# EAGLE design mowgli_1 (EAGLE 7.6.0)
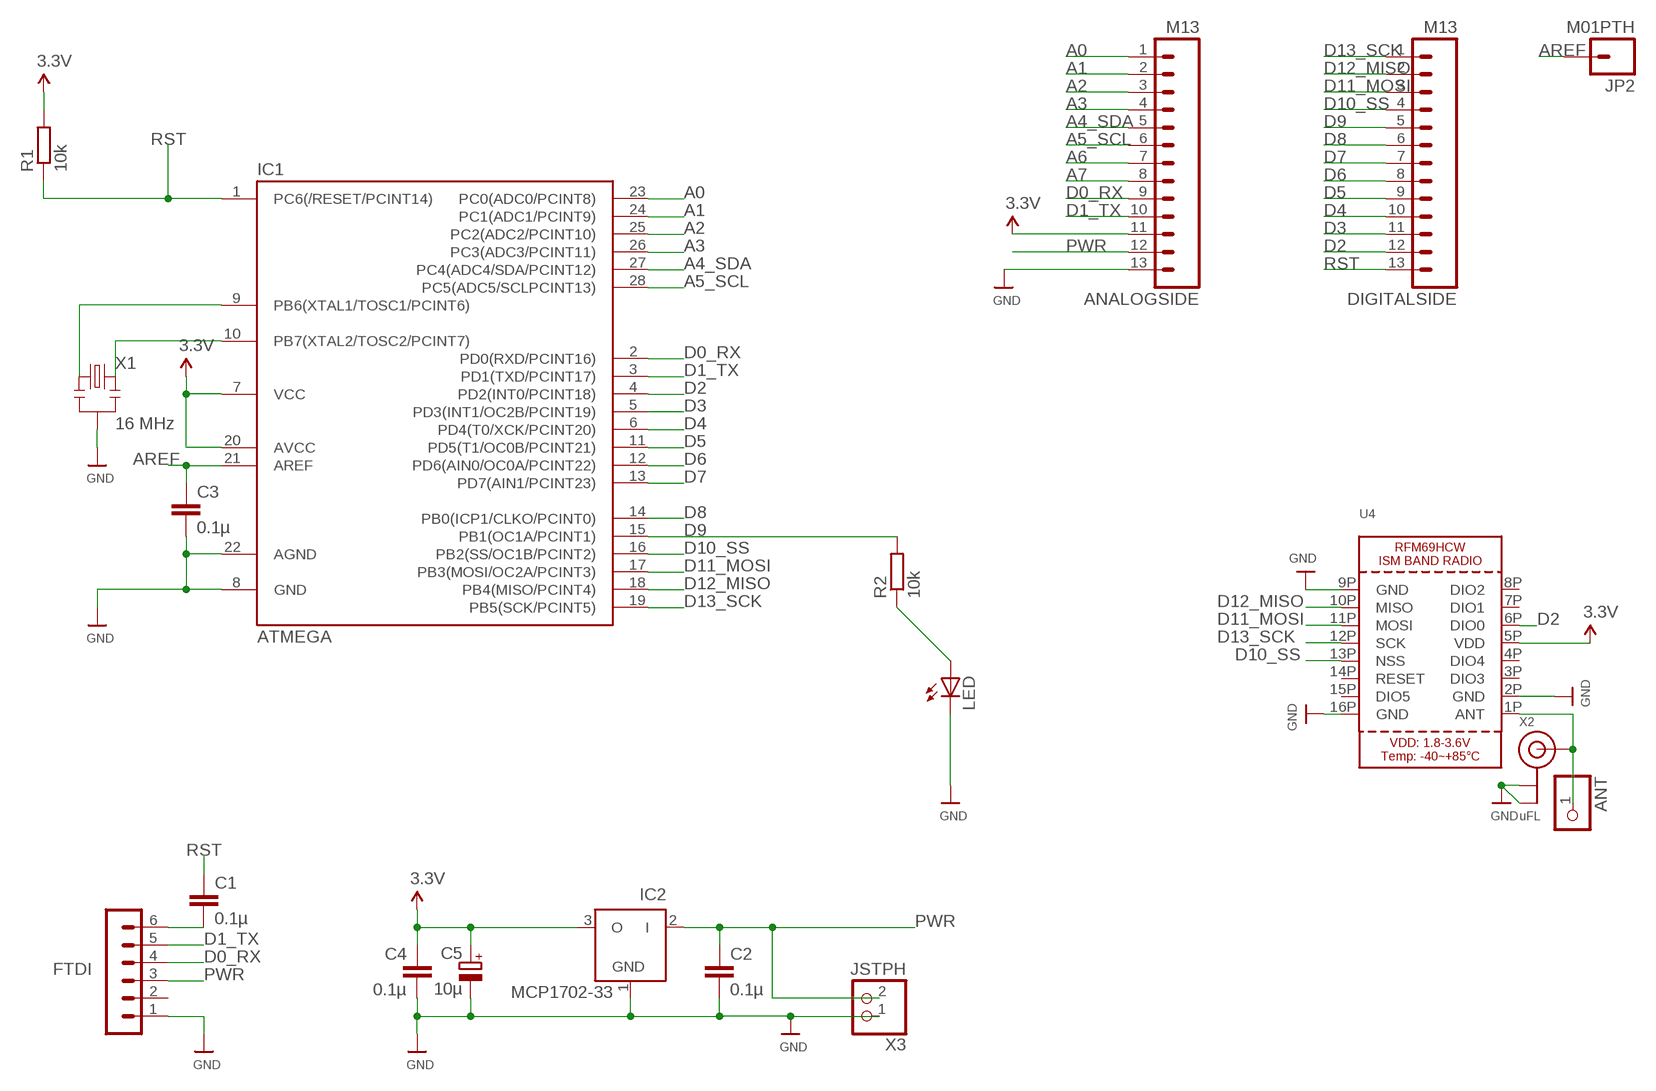
[diagram p0: schematic, sheet 1]

## Parts
ANALOGSIDE  M13  [1X13]
ANT  HEADER-1X1ROUND  [1X01_ROUND]
C1  0.1µ  C-EU025-024X044  [C025-024X044]
C2  0.1µ  C-EU025-024X044  [C025-024X044]
C3  0.1µ  C-EU025-024X044  [C025-024X044]
C4  0.1µ  C-EU025-024X044  [C025-024X044]
C5  10µ  CPOL-EUE1.8-4  [E1,8-4]
DIGITALSIDE  M13  [1X13]
FTDI  FTDI  MA06-1  [MA06-1]
IC1  ATMEGA  ATMEGA48/88/168-PU  [DIL28-3]
IC2  MCP1702-33  MCP1702Z  [TO92]
JP2  M01PTH  [1X01]
LED  LED3MM  [LED3MM]
R1  10k  R-EU_0204/7  [0204/7]
R2  10k  R-EU_0204/7  [0204/7]
U4  RFM69HCW_SMT  [RFMHCW_SMT]
X1  16 MHz  RESONATORPTH  [RESONATOR-PTH]
X2  uFL  ANTENNA_U.FL  [U.FL]
X3  JSTPH  CON_JST_PH_2PIN  [JSTPH2]

## Nets
A0: ANALOGSIDE.1 IC1.23(PC0(ADC0/PCINT8))
A1: ANALOGSIDE.2 IC1.24(PC1(ADC1/PCINT9))
A2: ANALOGSIDE.3 IC1.25(PC2(ADC2/PCINT10))
A3: ANALOGSIDE.4 IC1.26(PC3(ADC3/PCINT11))
A4_SDA: ANALOGSIDE.5 IC1.27(PC4(ADC4/SDA/PCINT12))
A5_SCL: ANALOGSIDE.6 IC1.28(PC5(ADC5/SCLPCINT13))
A6: ANALOGSIDE.7
A7: ANALOGSIDE.8
ANT: ANT.1 U4.1P(ANT) X2.3(SIGNAL)
AREF: C3.1 IC1.21(AREF) JP2.1
D0_RX: ANALOGSIDE.9 FTDI.4 IC1.2(PD0(RXD/PCINT16))
D1_TX: ANALOGSIDE.10 FTDI.5 IC1.3(PD1(TXD/PCINT17))
D2: DIGITALSIDE.12 IC1.4(PD2(INT0/PCINT18)) U4.6P(DIO0)
D3: DIGITALSIDE.11 IC1.5(PD3(INT1/OC2B/PCINT19))
D4: DIGITALSIDE.10 IC1.6(PD4(T0/XCK/PCINT20))
D5: DIGITALSIDE.9 IC1.11(PD5(T1/OC0B/PCINT21))
D6: DIGITALSIDE.8 IC1.12(PD6(AIN0/OC0A/PCINT22))
D7: DIGITALSIDE.7 IC1.13(PD7(AIN1/PCINT23))
D8: DIGITALSIDE.6 IC1.14(PB0(ICP1/CLKO/PCINT0))
D9: DIGITALSIDE.5 IC1.15(PB1(OC1A/PCINT1)) R2.2
D10_SS: DIGITALSIDE.4 IC1.16(PB2(SS/OC1B/PCINT2)) U4.13P(NSS)
D11_MOSI: DIGITALSIDE.3 IC1.17(PB3(MOSI/OC2A/PCINT3)) U4.11P(MOSI)
D12_MISO: DIGITALSIDE.2 IC1.18(PB4(MISO/PCINT4)) U4.10P(MISO)
D13_SCK: DIGITALSIDE.1 IC1.19(PB5(SCK/PCINT5)) U4.12P(SCK)
GND [power]: ANALOGSIDE.13 C2.2 C3.2 C4.2 C5.- FTDI.1 IC1.8(GND) IC1.22(AGND) IC2.1(GND) LED.K(C) U4.2P(GND) U4.9P(GND) U4.16P(GND) X1.2 X2.1(GND) X2.2(GND) X3.1
N$1: IC1.9(PB6(XTAL1/TOSC1/PCINT6)) X1.1
N$2: LED.A R2.1
N$20: C1.2 FTDI.6
N$21: IC1.10(PB7(XTAL2/TOSC2/PCINT7)) X1.3
PWR [power]: ANALOGSIDE.12 C2.1 FTDI.3 IC2.2(I) X3.2
RST: C1.1 DIGITALSIDE.13 IC1.1(PC6(/RESET/PCINT14)) R1.1
VCC [power]: ANALOGSIDE.11 C4.1 C5.+ IC1.7(VCC) IC1.20(AVCC) IC2.3(O) R1.2 U4.5P(VDD) ; supply symbol labelled 3.3V
Unconnected: FTDI.2 U4.3P(DIO3) U4.4P(DIO4) U4.7P(DIO1) U4.8P(DIO2) U4.14P(RESET) U4.15P(DIO5)

## Library data of the parts
ANALOGSIDE DIGITALSIDE = SparkFun-Connectors:M13: 13-pin single row .1" header
ANT = microbuilder:HEADER-1X1: PIN HEADER
C1-C4 = resistor:C-EU: CAPACITOR, European symbol
C5 = resistor:CPOL-EU: POLARIZED CAPACITOR, European symbol
FTDI = JeeLabs:MA06-1: PIN HEADER
IC1 = atmega8:ATMEGA48/88/168-PU
IC2 = JeeLabs:MCP1702: 200 mA, Low Power Low Dropout Voltage Regulator
JP2 = SparkFun-Connectors:M01: Header 1 Standard 1-pin 0.1" header. Use with straight break away headers (SKU : PRT-00116), right angle break away headers (PRT-00553), swiss pins (PRT-00743), machine pins (PRT-00117), and female headers (PRT-00115).
LED = led:LED: LED OSRAM: - CHIPLED LG R971, LG N971, LY N971, LG Q971, LY Q971, LO R971, LY R971 LH N974, LH R974 LS Q976, LO Q976, LY Q976 LO Q996 - Hyper CHIPLED LW Q18S LB Q993, LB Q99A, LB R99A - SideLED LS A670, LO A670, LY A670, LG A670, LP A670 LB A673, LV A673, LT A673, LW A673 LH A674 LY A675 LS A676, LA A676, LO A676, LY A676, LW A676 LS A679, LY A679, LG A679 - Hyper Micro SIDELED® LS Y876, LA Y876, LO Y876, LY Y876 LT Y87S - SmartLED LW L88C, LW L88S LB L89C, LB L89S, LG L890 LS L89K, LO L89K, LY L89K LS L896, LA L896, LO L896, LY L896 - TOPLED LS T670, LO T670, LY T670, LG T670, LP T670 LSG T670, LSP T670, LSY T670, LOP T670, LYG T670 LG T671, LOG T671, LSG T671 LB T673, LV T673, LT T673, LW T673 LH T674 LS T676, LA T676, LO T676, LY T676, LB T676, LH T676, LSB T676, LW T676 LB T67C, LV T67C, LT T67C, LS T67K, LO T67K, LY T67K, LW E67C LS E67B, LA E67B, LO E67B, LY E67B, LB E67C, LV E67C, LT E67C LW T67C LS T679, LY T679, LG T679 LS T770, LO T770, LY T770, LG T770, LP T770 LB T773, LV T773, LT T773, LW T773 LH T774 LS E675, LA E675, LY E675, LS T675 LS T776, LA T776, LO T776, LY T776, LB T776 LHGB T686 LT T68C, LB T68C - Hyper Mini TOPLED® LB M676 - Mini TOPLED Santana® LG M470 LS M47K, LO M47K, LY M47K Source: http://www.osram.convergy.de LUXEON: - LUMILED® LXK2-PW12-R00, LXK2-PW12-S00, LXK2-PW14-U00, LXK2-PW14-V00 LXK2-PM12-R00, LXK2-PM12-S00, LXK2-PM14-U00 LXK2-PE12-Q00, LXK2-PE12-R00, LXK2-PE12-S00, LXK2-PE14-T00, LXK2-PE14-U00 LXK2-PB12-K00, LXK2-PB12-L00, LXK2-PB12-M00, LXK2-PB14-N00, LXK2-PB14-P00, LXK2-PB14-Q00 LXK2-PR12-L00, LXK2-PR12-M00, LXK2-PR14-Q00, LXK2-PR14-R00 LXK2-PD12-Q00, LXK2-PD12-R00, LXK2-PD12-S00 LXK2-PH12-R00, LXK2-PH12-S00 LXK2-PL12-P00, LXK2-PL12-Q00, LXK2-PL12-R00 Source: www.luxeon.com KINGBRIGHT: KA-3528ASYC Source: www.kingbright.com
R1 R2 = resistor:R-EU_: RESISTOR, European symbol
U4 = microbuilder:RFM69HCW: RFM69HCW - ISM Band RF Transceiver
X1 = SparkFun:RESONATOR: Resonator Small SMD resonator. This is the itty bitty 10/20MHz resonators with built in caps. CSTCE10M0G55 and CSTCE20M0V53. Footprint has been reviewed closely but hasn't been tested yet.
X2 = microbuilder:ANTENNA_U.FL: U.FL Antenna Connector
X3 = microbuilder:CON_JST_PH_2PIN: JST 2-Pin Right-Angle Connector PH-Series - 4UConnector: 17311 SH-Series - 4UConnector: 07278

## Net classes
1 power: width 0.381 mm, clearance 0.254 mm

## Board
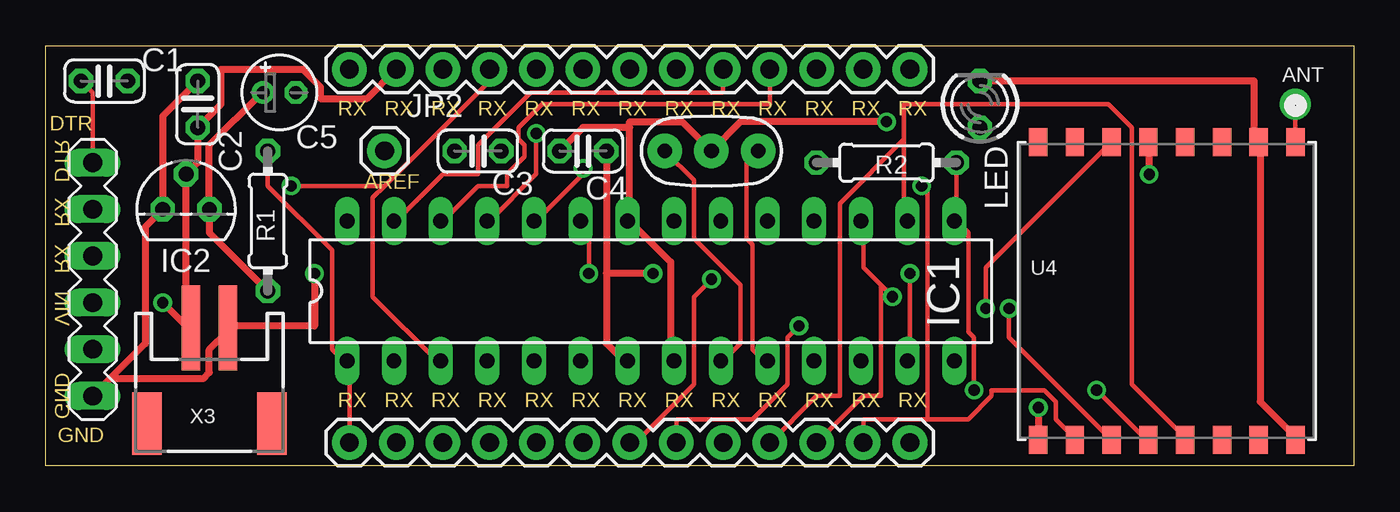
[diagram p1: board, top side]
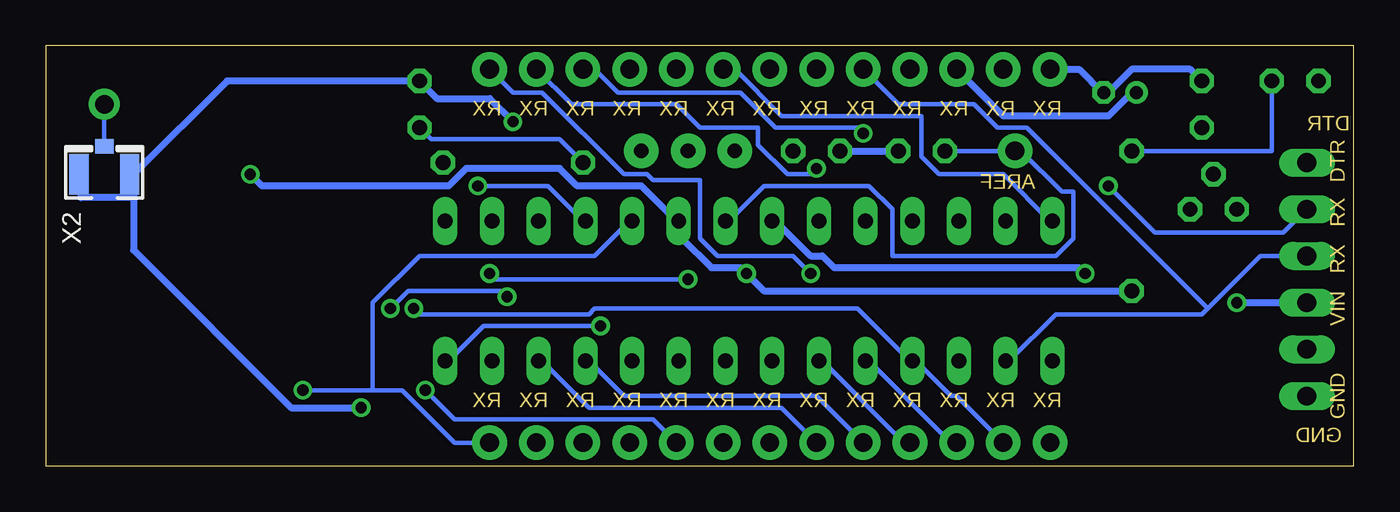
[diagram p2: board, bottom side, seen from below]

Size 71.12 x 22.86 mm. Coordinates in mm from the lower left corner, seen from the top.
Outline: 0,0 0,22.86 71.12,22.86 71.12,0 0,0
Copper layers (1*16): Top 0.035mm / dielectric 1.5mm / Bottom 0.035mm
Design rules "default": minimum track width 10mil, minimum drill 24mil, track to track 8mil, track to pad 8mil, pad to pad 8mil, via to via 8mil, smd to smd 8mil, copper to edge 40mil, drill to drill 8mil, minimum pad ring 10mil, minimum via ring 8mil, stop-mask expansion 4mil, vias tented up to drill 0mil, thermal gap 10mil

### Footprints (pad centres in the part's own frame; a part is rotated, then mirrored left to right if it is on the bottom)
1X13 = drill 1.016 pad 1.88: 1 0,0; 2 2.54,0; 3 5.08,0; 4 7.62,0; 5 10.16,0; 6 12.7,0; 7 15.24,0; 8 17.78,0; 9 20.32,0; 10 22.86,0; 11 25.4,0; 12 27.94,0; 13 30.48,0
1X01_ROUND = drill 1 pad 1.676: 1 0,0
C025-024X044 = drill 0.813 octagon: 1 -1.27,0; 2 1.27,0
E1,8-4 = drill 0.711 pad 1.168: + -0.889,0 | drill 0.711 pad 1.168 octagon: - 0.889,0
MA06-1 = drill 1.016 long: 1 0,0; 2 2.54,0; 3 5.08,0; 4 7.62,0; 5 10.16,0; 6 12.7,0
DIL28-3 = drill 0.813 long: 1 -16.51,-3.81; 2 -13.97,-3.81; 3 -11.43,-3.81; 4 -8.89,-3.81; 5 -6.35,-3.81; 6 -3.81,-3.81; 7 -1.27,-3.81; 8 1.27,-3.81; 9 3.81,-3.81; 10 6.35,-3.81; 11 8.89,-3.81; 12 11.43,-3.81; 13 13.97,-3.81; 14 16.51,-3.81; 15 16.51,3.81; 16 13.97,3.81; 17 11.43,3.81; 18 8.89,3.81; 19 6.35,3.81; 20 3.81,3.81; 21 1.27,3.81; 22 -1.27,3.81; 23 -3.81,3.81; 24 -6.35,3.81; 25 -8.89,3.81; 26 -11.43,3.81; 27 -13.97,3.81; 28 -16.51,3.81
TO92 = drill 0.813 octagon: 1 -1.27,0; 2 0,1.905; 3 1.27,0
1X01 = drill 1.016 pad 1.88: 1 0,0
LED3MM = drill 0.813 octagon: A -1.27,0; K 1.27,0
0204/7 = drill 0.813 octagon: 1 -3.81,0; 2 3.81,0
RFMHCW_SMT = smd 1.5 x 1: 1P 8.1,-7; 2P 8.1,-5; 3P 8.1,-3; 4P 8.1,-1; 5P 8.1,1; 6P 8.1,3; 7P 8.1,5; 8P 8.1,7; 9P -8.1,7; 10P -8.1,5; 11P -8.1,3; 12P -8.1,1; 13P -8.1,-1; 14P -8.1,-3; 15P -8.1,-5; 16P -8.1,-7
RESONATOR-PTH = drill 0.8 pad 1.88: 1 -2.54,0; 2 0,0; 3 2.54,0
U.FL = smd 2.2 x 1.05: 1 0,1.375; 2 0,-1.375 | smd 0.8 x 1: 3 1.525,0
JSTPH2 = smd 1 x 4.6: 1 -1,-3.7; 2 1,-3.7 | smd 1.6 x 3.4: NC1 -3.4,1.5; NC2 3.4,1.5

### Placement (x,y rotation side)
ANALOGSIDE  46.99,21.59 180 top
ANT  67.94,19.68 0 top
C1  3.17,20.95 180 top
C2  8.26,19.68 90 top
C3  23.5,17.14 0 top
C4  29.21,17.14 180 top
C5  12.7,20.32 0 top
DIGITALSIDE  46.99,1.27 180 top
FTDI  2.54,3.81 90 top
IC1  32.89,9.53 0 top
IC2  7.62,13.97 0 top
JP2  18.41,17.14 0 top
LED  50.8,19.68 90 top
R1  12.06,13.34 270 top
R2  45.72,16.51 0 top
U4  60.96,9.53 90 top
X1  36.2,17.14 0 top
X2  67.94,15.88 90 bottom
X3  8.89,3.81 180 top

### Tracks (layer width: path | path; a pad name or v marks a point on that pad's centre or on a via)
A0  (via drill 0.61)
  Top 0.254: v29.53,10.48 29.53,13.02 29.21,13.34 IC1.23
  Bottom 0.254: v29.53,10.48 30.48,11.43 34.61,11.43 35.56,12.38 35.56,15.56 38.1,15.56 38.42,15.88 39.69,15.88 44.13,20.32 45.72,20.32 ANALOGSIDE.1
A1  (via drill 0.61)
  Top 0.254: v29.21,16.19 29.21,15.88 26.67,13.34 IC1.24
  Bottom 0.254: v29.21,16.19 29.53,15.88 30.8,15.88 32.38,17.46 32.38,18.41 35.56,18.41 36.83,19.68 42.55,19.68 ANALOGSIDE.2
A2  (via drill 0.61)
  Top 0.254: v26.67,18.1 26.67,15.88 24.13,13.34 IC1.25
  Bottom 0.254: v26.67,18.1 26.99,18.41 31.43,18.41 33.34,20.32 40.01,20.32 41.27,21.59 ANALOGSIDE.3
A3
  Top 0.254: ANALOGSIDE.4 39.37,19.68 26.99,19.68 25.72,18.41 25.72,17.78 26.04,17.46 26.04,16.83 25.08,15.88 25.08,15.24 23.5,15.24 21.59,13.34 IC1.26
A4_SDA
  Top 0.254: ANALOGSIDE.5 36.83,20.32 26.35,20.32 23.5,17.46 23.5,15.88 21.59,15.88 19.05,13.34 IC1.27
A5_SCL
  Bottom 0.254: ANALOGSIDE.6 33.66,21.59 31.11,19.05 23.5,19.05 23.5,16.83 22.54,15.88 19.05,15.88 16.51,13.34 IC1.28
ANT
  Top 0.254: ANT.1 67.94,17.78 U4.1P
  Bottom 0.254: ANT.1 X2.3
AREF
  Bottom 0.254: IC1.21 33.97,13.34 32.07,15.24 26.35,15.24 25.08,13.97 25.08,11.43 16.19,11.43 15.24,12.38 15.24,14.92 15.88,14.92 18.1,17.14 JP2.1 C3.1
D0_RX
  Bottom 0.254: 7.94,8.57 5.08,11.43 FTDI.4 | 7.94,8.57 8.26,8.26 16.19,8.26 18.73,5.71 IC1.2 | ANALOGSIDE.9 24.77,19.68 20.64,19.68 19.37,18.41 17.78,18.41 7.94,8.57
D1_TX  (via drill 0.61)
  Top 0.254: 18.41,15.24 24.13,20.95 ANALOGSIDE.10 | 18.41,15.24 17.78,14.61 17.78,9.21 21.27,5.71 IC1.3 | 18.41,15.24 v13.34,15.24
  Bottom 0.254: FTDI.5 3.81,12.7 10.79,12.7 v13.34,15.24
D2  (via drill 0.61)
  Top 0.254: v51.12,8.57 51.12,10.79 57.78,17.46 U4.6P
  Bottom 0.254: v51.12,8.57 50.8,8.26 41.59,8.26 41.27,8.57 26.99,8.57 24.13,5.71 IC1.4 23.81,5.71 21.91,3.81 21.59,3.81 DIGITALSIDE.12
D3
  Bottom 0.254: DIGITALSIDE.11 21.91,1.27 26.35,5.71 IC1.5
D4
  Bottom 0.254: DIGITALSIDE.10 24.45,1.27 28.89,5.71 IC1.6
D5
  Bottom 0.254: DIGITALSIDE.9 29.21,3.81 39.69,3.81 41.59,5.71 IC1.11
D6
  Bottom 0.254: DIGITALSIDE.8 31.11,3.17 41.59,3.17 44.13,5.71 IC1.12
D7  (via drill 0.61)
  Top 0.254: v46.99,10.48 46.99,5.71 IC1.13 | v36.2,10.16 35.24,9.21 35.24,4.45 32.07,1.27 DIGITALSIDE.7
  Bottom 0.254: v46.99,10.48 46.67,10.16 v36.2,10.16
D8  (via drill 0.61)
  Top 0.254: v40.96,7.62 40.32,6.99 40.32,4.45 38.42,2.54 34.29,2.54 DIGITALSIDE.6
  Bottom 0.254: v40.96,7.62 47.31,7.62 49.21,5.71 IC1.14
D9  (via drill 0.61)
  Top 0.254: R2.2 49.53,13.34 | 49.53,13.34 50.16,12.7 50.16,7.3 50.48,6.99 v50.48,4.13 | 49.53,13.34 IC1.15
  Bottom 0.254: v50.48,4.13 48.9,2.54 38.1,2.54 DIGITALSIDE.5
D10_SS
  Top 0.254: 46.67,17.78 46.67,13.34 IC1.16 | 46.67,17.78 46.67,19.68 57.78,19.68 59.05,18.41 59.05,4.45 61.91,1.59 U4.13P | DIGITALSIDE.4 41.91,3.81 43.18,3.81 43.18,14.29 46.67,17.78
D11_MOSI  (via drill 0.61)
  Top 0.254: v52.39,8.57 52.39,6.99 57.78,1.59 U4.11P | 45.4,9.84 44.45,10.79 44.45,13.34 IC1.17 | 45.4,9.84 v46.04,9.21 | DIGITALSIDE.3 44.45,3.81 45.4,3.81 45.4,9.84
  Bottom 0.254: v52.39,8.57 51.44,9.53 46.35,9.53 v46.04,9.21
D12_MISO  (via drill 0.61)
  Top 0.254: 47.94,2.54 44.45,2.54 DIGITALSIDE.2 | 47.94,2.54 50.16,2.54 51.44,3.81 51.44,4.13 54.29,4.13 54.93,3.49 54.93,2.54 55.88,1.59 U4.10P | v47.62,15.24 47.94,14.92 47.94,2.54
  Bottom 0.254: v47.62,15.24 43.81,15.24 41.91,13.34 IC1.18
D13_SCK  (via drill 0.61)
  Top 0.254: v57.15,4.13 59.69,1.59 U4.12P
  Bottom 0.254: 53.34,4.13 51.75,4.13 48.9,1.27 DIGITALSIDE.1 | 53.34,4.13 v57.15,4.13 | 53.34,4.13 53.34,8.89 50.8,11.43 41.27,11.43 39.37,13.34 IC1.19
GND  (via drill 0.61)
  Top 0.381: C2.2 6.35,19.05 IC2.1 5.4,13.02 5.4,6.67 3.49,4.76 | 3.49,4.76 FTDI.1 | 3.49,4.76 8.57,4.76 8.89,5.08 8.89,6.35 9.84,7.3 X3.1 10.16,7.62 14.61,7.62 v14.61,10.48 | v53.98,3.17 53.98,1.59 U4.9P | 31.75,13.34 33.97,11.11 33.97,5.71 IC1.8 | C4.2 29.21,18.41 31.75,18.41 | 31.75,13.34 31.75,18.41 | 31.75,13.34 IC1.22 | 31.75,18.41 31.75,18.73 34.61,18.73 X1.2 37.78,18.73 v45.72,18.73 | U4.16P 67.94,1.59 66.04,3.49 66.04,17.46 U4.2P 65.72,17.78 65.72,20.95 LED.K
  Bottom 0.381: ANALOGSIDE.13 14.92,21.59 13.65,20.32 C5.- 13.34,20.32 12.06,21.59 8.89,21.59 C2.2 | v53.98,3.17 57.78,3.17 66.36,11.75 66.36,14.61 | 66.36,15.88 66.36,14.61 | 66.36,14.61 69.22,14.61 69.22,15.88 X2.1 | C4.2 C3.2 | v45.72,18.73 46.99,20 49.85,20 LED.K 61.28,20.95 66.36,15.88 | 66.36,15.88 X2.2 | v14.61,10.48 14.92,10.79 28.26,10.79 28.89,11.43 29.53,11.43 31.43,13.34 IC1.22
N$1
  Top 0.254: X1.1 35.24,15.56 35.24,12.38 37.78,9.84 37.78,6.67 36.83,5.71 IC1.9
N$2
  Bottom 0.254: R2.1 43.18,17.78 50.16,17.78 LED.A
N$20
  Top 0.254: C1.2 2.54,20.32 FTDI.6
N$21
  Top 0.254: X1.3 38.1,16.51 38.1,12.38 38.42,12.06 38.42,6.35 39.05,5.71 IC1.10
PWR  (via drill 0.61)
  Top 0.381: 7.62,7.62 v6.35,8.89 | 7.62,7.62 IC2.2 8.26,16.51 C2.1 9.53,19.68 9.53,21.59 13.97,21.59 14.92,20.64 14.92,20 17.46,20 ANALOGSIDE.12 | 7.62,7.62 X3.2
  Bottom 0.381: v6.35,8.89 FTDI.3
RST
  Top 0.254: DIGITALSIDE.13 16.51,5.71 IC1.1 16.19,5.71 15.56,6.35 15.56,11.75 12.06,15.24 R1.1
  Bottom 0.254: C1.1 4.45,17.14 R1.1
VCC  (via drill 0.61)
  Top 0.381: C5.+ 11.75,20.32 8.89,17.46 IC2.3 8.89,12.7 R1.2 | C4.1 30.48,10.48 | 30.48,10.48 30.48,6.67 31.43,5.71 IC1.7 | v60.01,15.88 60.01,17.46 U4.5P | v33.02,10.48 30.48,10.48
  Bottom 0.381: ANALOGSIDE.11 19.05,19.05 13.34,19.05 12.06,20.32 C5.+ | v60.01,15.88 59.37,15.24 49.21,15.24 48.26,16.19 43.18,16.19 42.23,15.24 38.73,15.24 36.83,13.34 IC1.20 36.51,13.34 36.51,12.38 34.92,10.79 33.34,10.79 v33.02,10.48 32.07,9.53 R1.2

### Text on the board
Dimension: DTR | RX | RX | RX | RX | RX | RX | RX | RX | RX | RX | RX | RX | RX | DTR | AREF | RX | RX | VIN | GND | RX | RX | RX | RX | RX | RX | RX | RX | RX | RX | RX | RX | RX | GND